# EAGLE design passthru (EAGLE 9.6.2)
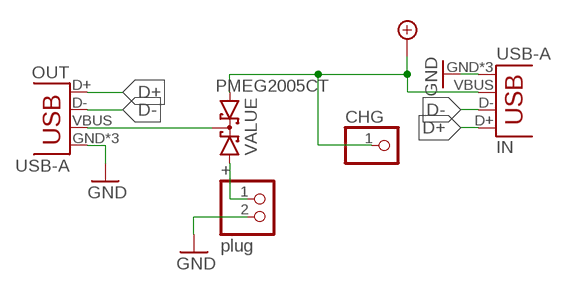
[diagram p0: schematic, sheet 1]

## Parts
+  plug  PINHD-1X2  [1X02]
CHG  PINHD-1X1  [1X01]
IN  USB-A  [USB-A-H]
OUT  USB-A  [USB-A-H]
PMEG2005CT  BAT54C  [SOT23]

## Nets
+5V: CHG.1 IN.VBUS PMEG2005CT.1(A1)
D+: IN.D+ OUT.D+
D-: IN.D- OUT.D-
GND: +.2 IN.GND IN.GND2(GND) IN.GND3(GND) OUT.GND OUT.GND2(GND) OUT.GND3(GND)
N$1: OUT.VBUS PMEG2005CT.3(CC)
N$2: +.1 PMEG2005CT.2(A2)

## Library data of the parts
+ = pinhead:PINHD-1X2: PIN HEADER
CHG = pinhead:PINHD-1X1: PIN HEADER
IN OUT = CuriousTech:USB-A
PMEG2005CT = diode:BAT54C: Schottky Diodes Source: Fairchild .. BAT54.pdf

## Board
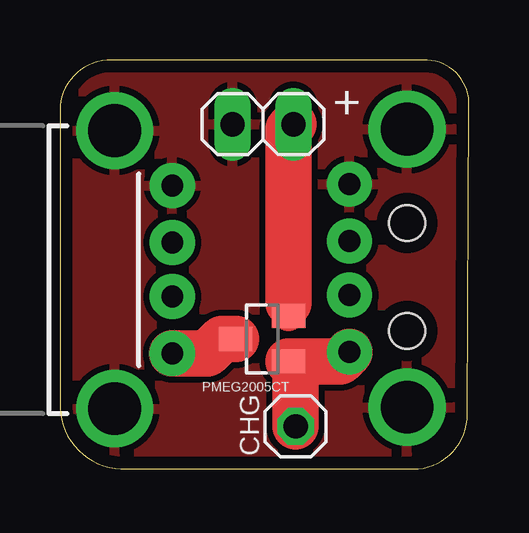
[diagram p1: board, top side]
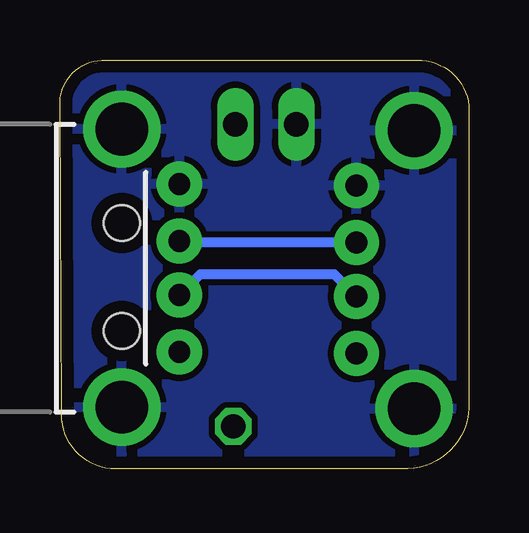
[diagram p2: board, bottom side, seen from below]

Size 17.06 x 17.06 mm. Coordinates in mm from the lower left corner, seen from the top.
Outline: 17.06,15.15 arc90 15.32,17.05 2.36,17.05 arc90 0,15.15 0,2.79 arc90 2.54,0 14.73,0 arc90 16.99,2.28 17.06,15.15
Copper layers (1*16): Top 0.035mm / dielectric 1.5mm / Bottom 0.035mm
Design rules "default *": minimum track width 10mil, minimum drill 24mil, track to track 8mil, track to pad 8mil, pad to pad 8mil, via to via 8mil, smd to smd 8mil, copper to edge 20mil, drill to drill 8mil, minimum pad ring 10mil, minimum via ring 8mil, stop-mask expansion 4mil, vias tented up to drill 0mil, thermal gap 10mil
Holes 1.5 mm at 14.48,5.76 14.48,10.26

### Footprints (pad centres in the part's own frame; a part is rotated, then mirrored left to right if it is on the bottom)
1X02 = drill 1.016 long: 1 -1.27,0; 2 1.27,0
1X01 = drill 1.016 octagon: 1 0,0
USB-A-H = drill 0.914 pad 1.88: D+ 7.48,1.127; D- 7.48,-1.127; GND 7.48,3.5; VBUS 7.48,-3.5 | drill 2.2: GND2 5.08,-5.8; GND3 5.08,5.8
SOT23 = smd 1 x 1.4: 1 -0.95,-1.1; 2 0.95,-1.1; 3 0,1.1

### Placement (x,y rotation side)
+  8.47,14.38 180 top
CHG  9.83,1.78 0 top
IN  19.56,8.38 0 bottom
OUT  -2.79,8.32 0 top
PMEG2005CT  8.44,5.43 90 top

### Tracks (layer width: path | path; a pad name or v marks a point on that pad's centre or on a via)
+5V
  Top 1.93: PMEG2005CT.1 11.69,4.48 12.08,4.87 IN.VBUS | PMEG2005CT.1 | CHG.1 9.83,4.19 PMEG2005CT.1
D+
  Bottom 0.406: OUT.D+ 12.02,9.45 IN.D+
D-
  Bottom 0.406: IN.D- 11.2,8.13 5.63,8.13 OUT.D-
GND
  pour Bottom (isolate 0.254): 17.02,-0.01 17.02,17.09 -0.07,17.07 -0.1,-0.01
  pour Top (isolate 0.254): 16.97,0 16.97,17.07 -0.1,17.07 -0.1,0
N$1
  Top 1.93: PMEG2005CT.3 6.76,5.43 6.15,4.82 OUT.VBUS
N$2
  Top 1.27: PMEG2005CT.2 9.54,6.92
  Top 1.93: 9.54,6.92 9.54,14.18 +.1